# EAGLE design board (EAGLE 7.7.0)
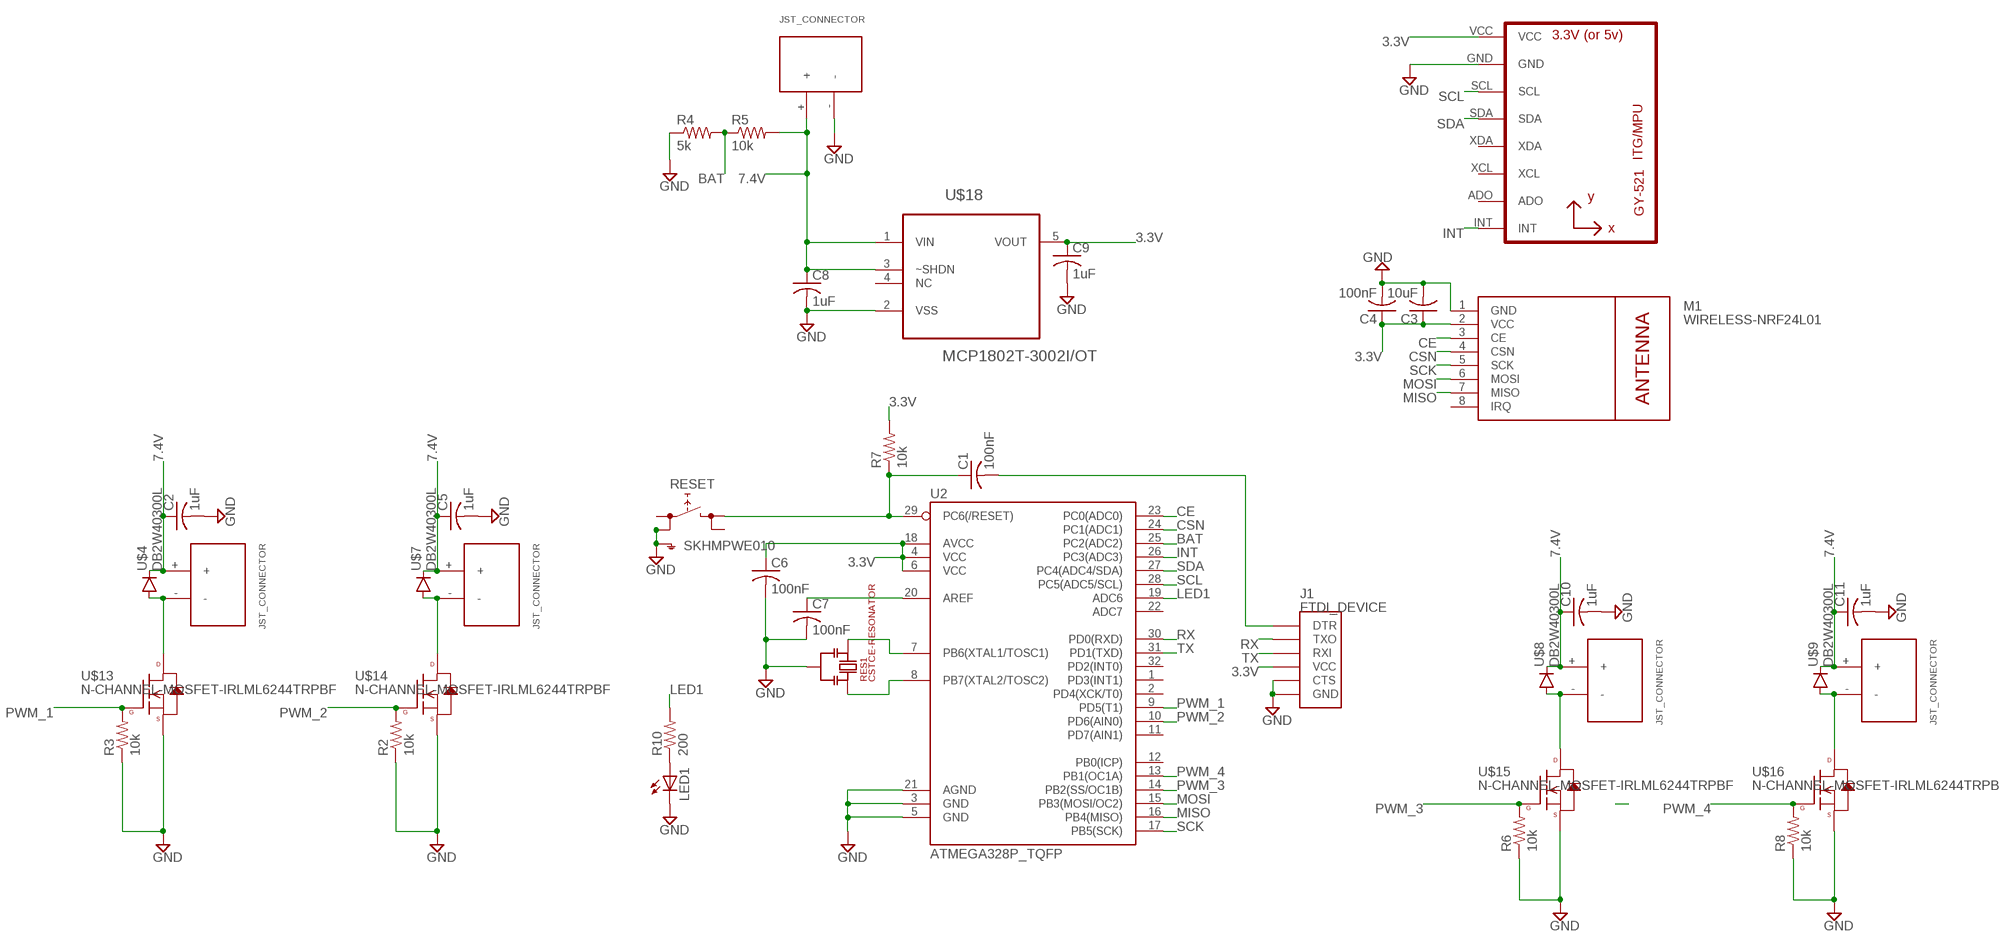
[diagram p0: schematic, sheet 1]

## Parts
C1  100nF  C-USC0603  [C0603]
C2  1uF  C-USC0603  [C0603]
C3  10uF  C-USC0603  [C0603]
C4  100nF  C-USC0603  [C0603]
C5  1uF  C-USC0603  [C0603]
C6  100nF  C-USC0603  [C0603]
C7  100nF  C-USC0603  [C0603]
C8  1uF  C-USC0603  [C0603]
C9  1uF  C-USC0603  [C0603]
C10  1uF  C-USC0603  [C0603]
C11  1uF  C-USC0603  [C0603]
J1  FTDI_DEVICE  [FTDI_DEVICE_SIDE]
LED1  LEDCHIP-LED0603  [CHIP-LED0603]
M1  WIRELESS-NRF24L01  [WIRELESS-NRF24L01]
R2  10k  R-US_R0603  [R0603]
R3  10k  R-US_R0603  [R0603]
R4  5k  R-US_R0603  [R0603]
R5  10k  R-US_R0603  [R0603]
R6  10k  R-US_R0603  [R0603]
R7  10k  R-US_R0603  [R0603]
R8  10k  R-US_R0603  [R0603]
R10  200  R-US_R0603  [R0603]
RES1  CSTCE-RESONATOR  [CSTCE16M0V53-R0]
RESET  SKHMPWE010  [SKHMPXE010]
U1  GY-521MPU6050  [GY-521]
U2  ATMEGA328P_TQFP  [TQFP32-08]
U$3  JST_CONNECTOR_FEMALE  [JST_CONNECTOR_FEMALE]
U$4  DB2W40300L  [MINI2-F3-B]
U$7  DB2W40300L  [MINI2-F3-B]
U$8  DB2W40300L  [MINI2-F3-B]
U$9  DB2W40300L  [MINI2-F3-B]
U$10  JST_CONNECTOR_FEMALE  [JST_CONNECTOR_FEMALE]
U$11  JST_CONNECTOR_FEMALE  [JST_CONNECTOR_FEMALE]
U$12  JST_CONNECTOR_FEMALE  [JST_CONNECTOR_FEMALE]
U$13  N-CHANNEL-MOSFET-IRLML6244TRPBF  [SOT23-3]
U$14  N-CHANNEL-MOSFET-IRLML6244TRPBF  [SOT23-3]
U$15  N-CHANNEL-MOSFET-IRLML6244TRPBF  [SOT23-3]
U$16  N-CHANNEL-MOSFET-IRLML6244TRPBF  [SOT23-3]
U$17  JST_CONNECTOR_FEMALE  [JST_CONNECTOR_FEMALE]
U$18  MCP1802T-3002I/OT  [SOT95P270X145-5N]

## Nets
3.3V: C3.1 C4.1 C6.1 C9.1 J1.P$4(VCC) M1.2(VCC) R7.2 U1.VCC U2.4(VCC) U2.6(VCC) U2.18(AVCC) U$18.5(VOUT)
7.4V: C2.1 C5.1 C8.1 C10.1 C11.1 R5.2 U$3.+ U$4.NEG(GPIN) U$7.NEG(GPIN) U$8.NEG(GPIN) U$9.NEG(GPIN) U$10.+ U$11.+ U$12.+ U$17.+ U$18.1(VIN) U$18.3(~SHDN)
BAT: R4.2 R5.1 U2.25(PC2(ADC2))
CE: M1.3(CE) U2.23(PC0(ADC0))
CSN: M1.4(CSN) U2.24(PC1(ADC1))
GND: C2.2 C3.2 C4.2 C5.2 C6.2 C7.2 C8.2 C9.2 C10.2 C11.2 J1.P$5(CTS) J1.P$6(GND) LED1.C M1.1(GND) R2.1 R3.1 R4.1 R6.1 R8.1 RES1.P$2 RESET.2(1.2) RESET.5(SH) U1.GND U2.3(GND) U2.5(GND) U2.21(AGND) U$13.2(S) U$14.2(S) U$15.2(S) U$16.2(S) U$17.- U$18.2(VSS)
INT: U1.INT U2.26(PC3(ADC3))
LED1: R10.2 U2.19(ADC6)
MISO: M1.7(MISO) U2.16(PB4(MISO))
MOSI: M1.6(MOSI) U2.15(PB3(MOSI/OC2))
N$1: RES1.P$3 U2.7(PB6(XTAL1/TOSC1))
N$2: RES1.P$1 U2.8(PB7(XTAL2/TOSC2))
N$3: U$8.POS(PPIN) U$11.- U$15.3(D)
N$8: LED1.A R10.1
N$11: C7.1 U2.20(AREF)
N$12: C1.1 R7.1 RESET.3(2.1) U2.29(PC6(/RESET))
N$13: C1.2 J1.P$1(DTR)
N$15: U$3.- U$4.POS(PPIN) U$13.3(D)
N$17: U$7.POS(PPIN) U$10.- U$14.3(D)
N$21: U$9.POS(PPIN) U$12.- U$16.3(D)
PWM_1: R3.2 U2.9(PD5(T1)) U$13.1(G)
PWM_2: R2.2 U2.10(PD6(AIN0)) U$14.1(G)
PWM_3: R6.2 U2.14(PB2(SS/OC1B)) U$15.1(G)
PWM_4: R8.2 U2.13(PB1(OC1A)) U$16.1(G)
RX: J1.P$2(TXO) U2.30(PD0(RXD))
SCK: M1.5(SCK) U2.17(PB5(SCK))
SCL: U1.SCL U2.28(PC5(ADC5/SCL))
SDA: U1.SDA U2.27(PC4(ADC4/SDA))
TX: J1.P$3(RXI) U2.31(PD1(TXD))
Unconnected: M1.8(IRQ) RESET.1(1.1) RESET.4(2.2) U1.ADO U1.XCL U1.XDA U2.1(PD3(INT1)) U2.2(PD4(XCK/T0)) U2.11(PD7(AIN1)) U2.12(PB0(ICP)) U2.22(ADC7) U2.32(PD2(INT0)) U$18.4(NC)

## Library data of the parts
C1-C11 = rcl:C-US: CAPACITOR, American symbol
J1 = quad:FTDI_DEVICE: Connector which mates to FTDI basic or FTDI cable.
LED1 = led:LED: LED OSRAM: - CHIPLED LG R971, LG N971, LY N971, LG Q971, LY Q971, LO R971, LY R971 LH N974, LH R974 LS Q976, LO Q976, LY Q976 LO Q996 - Hyper CHIPLED LW Q18S LB Q993, LB Q99A, LB R99A - SideLED LS A670, LO A670, LY A670, LG A670, LP A670 LB A673, LV A673, LT A673, LW A673 LH A674 LY A675 LS A676, LA A676, LO A676, LY A676, LW A676 LS A679, LY A679, LG A679 - Hyper Micro SIDELED® LS Y876, LA Y876, LO Y876, LY Y876 LT Y87S - SmartLED LW L88C, LW L88S LB L89C, LB L89S, LG L890 LS L89K, LO L89K, LY L89K LS L896, LA L896, LO L896, LY L896 - TOPLED LS T670, LO T670, LY T670, LG T670, LP T670 LSG T670, LSP T670, LSY T670, LOP T670, LYG T670 LG T671, LOG T671, LSG T671 LB T673, LV T673, LT T673, LW T673 LH T674 LS T676, LA T676, LO T676, LY T676, LB T676, LH T676, LSB T676, LW T676 LB T67C, LV T67C, LT T67C, LS T67K, LO T67K, LY T67K, LW E67C LS E67B, LA E67B, LO E67B, LY E67B, LB E67C, LV E67C, LT E67C LW T67C LS T679, LY T679, LG T679 LS T770, LO T770, LY T770, LG T770, LP T770 LB T773, LV T773, LT T773, LW T773 LH T774 LS E675, LA E675, LY E675, LS T675 LS T776, LA T776, LO T776, LY T776, LB T776 LHGB T686 LT T68C, LB T68C - Hyper Mini TOPLED® LB M676 - Mini TOPLED Santana® LG M470 LS M47K, LO M47K, LY M47K Source: http://www.osram.convergy.de LUXEON: - LUMILED® LXK2-PW12-R00, LXK2-PW12-S00, LXK2-PW14-U00, LXK2-PW14-V00 LXK2-PM12-R00, LXK2-PM12-S00, LXK2-PM14-U00 LXK2-PE12-Q00, LXK2-PE12-R00, LXK2-PE12-S00, LXK2-PE14-T00, LXK2-PE14-U00 LXK2-PB12-K00, LXK2-PB12-L00, LXK2-PB12-M00, LXK2-PB14-N00, LXK2-PB14-P00, LXK2-PB14-Q00 LXK2-PR12-L00, LXK2-PR12-M00, LXK2-PR14-Q00, LXK2-PR14-R00 LXK2-PD12-Q00, LXK2-PD12-R00, LXK2-PD12-S00 LXK2-PH12-R00, LXK2-PH12-S00 LXK2-PL12-P00, LXK2-PL12-Q00, LXK2-PL12-R00 Source: www.luxeon.com KINGBRIGHT: KA-3528ASYC Source: www.kingbright.com
M1 = quad:WIRELESS-NRF24L01: 2.4 GHz Wireless Module based on NRF24L01 chip
R2-R8 R10 = rcl:R-US_: RESISTOR, American symbol
RES1 = quad:CSTCE-RESONATOR: Murata Electronics Resonator
RESET = switch:SKHMP*E010: 6.2 X 6.5mm TACT Switch (SMD) Source: http://www3.alps.co.jp/WebObjects/catalog.woa/PDF/E/Switch/Tact/SKHM/SKHM.PDF
U1 = quad:GY-521
U2 = quad:ATMEGA328P_TQFP; PROD_ID: IC-09069
U$3 U$10-U$12 U$17 = quad:JST_CONNECTOR_FEMALE
U$4 U$7-U$9 = quad:DB2W40300L
U$13-U$16 = quad:N-CHANNEL-MOSFET: N-Channel MOSFET Mode Field Effect Transistor; DATASHEET: http://www.mouser.com/ds/2/196/irlml6244pbf-936666.pdf; MOUSER: 942-IRLML6244TRPBF; URL: http://www.mouser.com/Search/ProductDetail.aspx?R=IRLML6244TRPBFvirtualkey57370000virtualkey942-IRLML6244TRPBF
U$18 = quad:MCP1802T-3002I/OT: Low Quiescent Current LDO; MPN: MCP1802T-3002I/OT; OC_FARNELL: 1578373; OC_NEWARK: 54M4837; PACKAGE: SOT-5; SUPPLIER: Microchip

## Net classes
0 default: clearance 0.205 mm

## Board
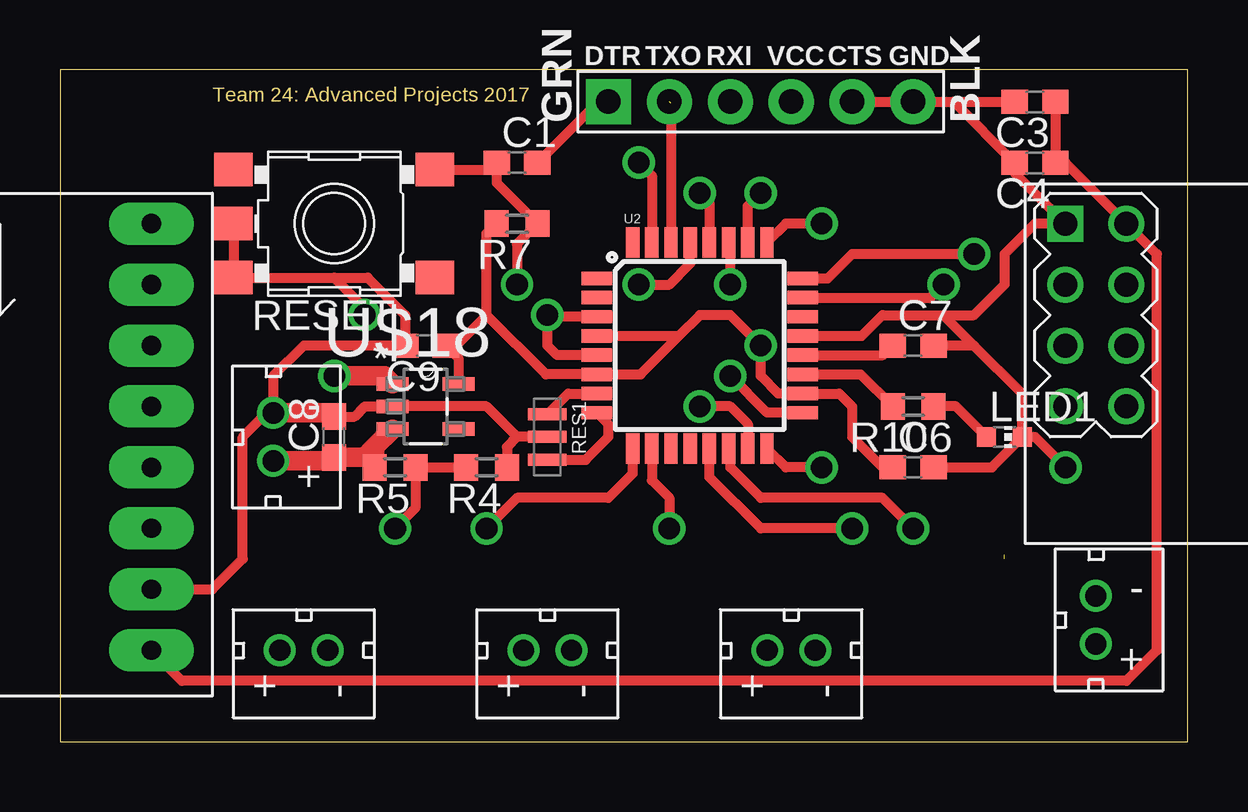
[diagram p1: board, top side]
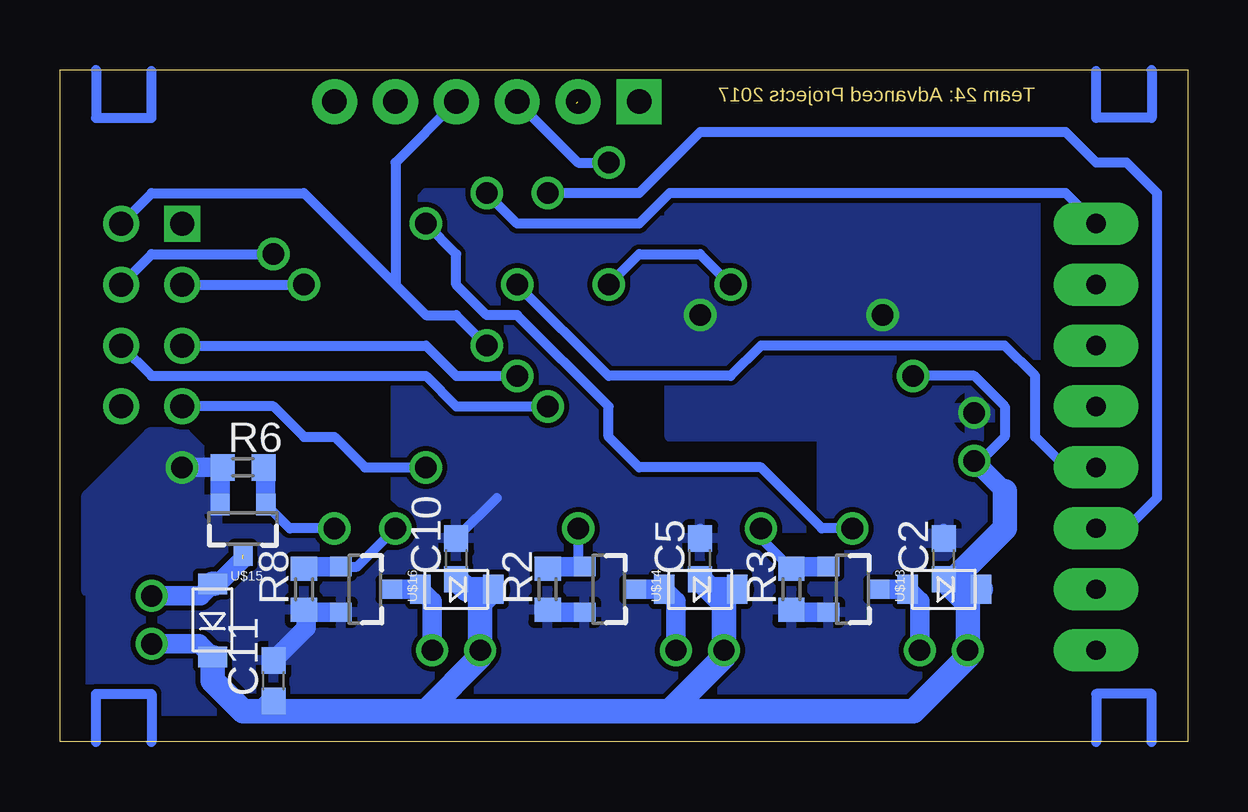
[diagram p2: board, bottom side, seen from below]

Size 47 x 28 mm. Coordinates in mm from the lower left corner, seen from the top.
Outline: 0,0 47,0 47,28 0,28 0,0
Copper layers (1*16): Top 0.0356mm / dielectric 1.5011mm / Bottom 0.0356mm
Design rules "LaenPCBOrder": minimum track width 6mil, minimum drill 13mil, track to track 6mil, track to pad 6mil, pad to pad 6mil, via to via 6mil, smd to smd 6mil, copper to edge 15mil, drill to drill 6mil, minimum pad ring 7mil, minimum via ring 7mil, stop-mask expansion 3mil, vias tented up to drill 0mil, thermal gap 10mil

### Footprints (pad centres in the part's own frame; a part is rotated, then mirrored left to right if it is on the bottom)
C0603 = smd 1.1 x 1: 1 -0.85,0; 2 0.85,0
FTDI_DEVICE_SIDE = drill 1.016 pad 1.88 square: P$1 -6.35,0 | drill 1.016 pad 1.88: P$2 -3.81,0; P$3 -1.27,0; P$4 1.27,0; P$5 3.81,0; P$6 6.35,0
CHIP-LED0603 = smd 0.8 x 0.8: A 0,-0.75; C 0,0.75
WIRELESS-NRF24L01 = drill 1 square: 1 -12.7,6.35 | drill 1: 2 -10.16,6.35; 3 -12.7,3.81; 4 -10.16,3.81; 5 -12.7,1.27; 6 -10.16,1.27; 7 -12.7,-1.27; 8 -10.16,-1.27
R0603 = smd 1 x 1.1: 1 -0.85,0; 2 0.85,0
CSTCE16M0V53-R0 = smd 1.6 x 0.5: P$1 0,0.95; P$2 0,0; P$3 0,-0.95
SKHMPXE010 = smd 1.6 x 1.4: 1 -4.2,2.25; 2 4.2,2.25; 3 -4.2,-2.25; 4 4.2,-2.25; 5 4.2,0
GY-521 = drill 0.8 pad 1.778 long: ADO -8.89,-6.35; GND -8.89,6.35; INT -8.89,-8.89; SCL -8.89,3.81; SDA -8.89,1.27; VCC -8.89,8.89; XCL -8.89,-3.81; XDA -8.89,-1.27
TQFP32-08 = smd 1.27 x 0.559: 1 -4.293,2.8; 2 -4.293,2; 3 -4.293,1.2; 4 -4.293,0.4; 5 -4.293,-0.4; 6 -4.293,-1.2; 7 -4.293,-2; 8 -4.293,-2.8; 17 4.293,-2.8; 18 4.293,-2; 19 4.293,-1.2; 20 4.293,-0.4; 21 4.293,0.4; 22 4.293,1.2; 23 4.293,2; 24 4.293,2.8 | smd 0.559 x 1.27: 9 -2.8,-4.293; 10 -2,-4.293; 11 -1.2,-4.293; 12 -0.4,-4.293; 13 0.4,-4.293; 14 1.2,-4.293; 15 2,-4.293; 16 2.8,-4.293; 25 2.8,4.293; 26 2,4.293; 27 1.2,4.293; 28 0.4,4.293; 29 -0.4,4.293; 30 -1.2,4.293; 31 -2,4.293; 32 -2.8,4.293
JST_CONNECTOR_FEMALE = drill 0.889: + 0,1; - 0,-1
MINI2-F3-B = smd 1.22 x 0.85: NEG 0,1.55; POS 0,-1.5
SOT23-3 = smd 0.8 x 0.9: 1 -0.95,-1; 2 0.95,-1; 3 0,1.1
SOT95P270X145-5N = smd 1.321 x 0.559: 1 -1.372,0.94; 2 -1.372,0; 3 -1.372,-0.94; 4 1.372,-0.94; 5 1.372,0.94

### Placement (x,y rotation side)
C1  19.05,24.13 0 top
C2  10.16,7.62 90 bottom
C3  40.64,26.67 180 top
C4  40.64,24.13 180 top
C5  20.32,7.62 90 bottom
C6  35.56,11.43 0 top
C7  35.56,16.51 0 top
C8  11.43,12.7 90 top
C9  15.24,16.51 180 top
C10  30.48,7.62 90 bottom
C11  38.1,2.54 90 bottom
J1  29.21,26.67 0 top
LED1  39.37,12.7 270 top
M1  54.61,15.24 0 top
R2  26.67,6.35 90 bottom
R3  16.51,6.35 90 bottom
R4  17.78,11.43 180 top
R5  13.97,11.43 180 top
R6  39.37,11.43 0 bottom
R7  19.05,21.59 180 top
R8  36.83,6.35 90 bottom
R10  35.56,13.97 180 top
RES1  20.32,12.7 180 top
RESET  11.43,21.59 180 top
U1  -5.08,12.7 180 top
U2  26.67,16.51 0 top
U$3  10.16,3.81 90 top
U$4  10.16,6.35 270 bottom
U$7  20.32,6.35 270 bottom
U$8  40.64,5.08 180 bottom
U$9  30.48,6.35 270 bottom
U$10  20.32,3.81 90 top
U$11  43.18,5.08 180 top
U$12  30.48,3.81 90 top
U$13  13.97,6.35 270 bottom
U$14  24.13,6.35 270 bottom
U$15  39.37,8.89 180 bottom
U$16  34.29,6.35 270 bottom
U$17  8.89,12.7 180 top
U$18  15.24,13.97 0 top

### Tracks (layer width: path | path; a pad name or v marks a point on that pad's centre or on a via)
3.3V  (via drill 0.9)
  Top 0.406: C6.1 34.29,11.43 33.02,12.7 33.02,13.97 32.48,14.51 U2.18 29.94,14.51 29.21,15.24 v29.21,16.51 27.94,17.78 26.67,17.78 25.8,16.91 | U$18.5 16.61,15.99 C9.1 16.51,16.51 17.78,17.78 | 17.78,17.78 17.78,21.17 R7.2 | U2.6 22.31,15.24 | 22.45,15.24 U2.6 | U2.6 20.25,15.31 17.78,17.78 | U2.6 24.2,15.31 25.8,16.91 | U2.4 25.8,16.91 | C3.1 C4.1 41.91,24.13 M1.2 45.72,20.32 45.72,3.81 44.45,2.54 5.08,2.54 U1.VCC
  Bottom 0.406: 33.02,19.05 31.75,17.78 30.48,17.78 v29.21,16.51 | J1.P$4 33.02,24.13 33.02,19.05 | M1.2 43.18,22.86 36.83,22.86 33.02,19.05
7.4V  (via drill 0.9)
  Top 0.406: 9.89,11.7 U$17.+ 8.62,11.7
  Top 0.813: U$17.+ 11.28,11.7 C8.1 12.69,11.85 13.12,12.28 | U$18.1 13.54,15.24 v11.43,15.24 | U$18.3 13.12,12.28 | 13.12,12.28 R5.2
  Bottom 0.406: v11.43,15.24 8.89,15.24 7.62,13.97 7.62,12.7 8.62,11.7
  Bottom 0.61: 8.62,11.7 U$17.+
  Bottom 0.813: U$12.+ 29.48,3.54 | U$8.NEG 41.19,4.08 U$11.+ | 7.62,10.43 U$17.+
  Bottom 1.016: 21.59,1.27 31.75,1.27 | 31.75,1.27 38.52,1.27 | U$8.NEG 40.64,2.54 39.37,1.27 38.52,1.27 | C11.1 38.52,1.27 | U$7.NEG 19.9,6.35 C5.1 19.32,5.77 U$10.+ 19.32,3.54 21.59,1.27 | C10.1 30.06,6.35 U$9.NEG 29.48,5.8 U$12.+ | 29.48,3.54 31.75,1.27 | 9.74,6.35 C2.1 9.74,6.77 7.62,8.89 7.62,10.43 | 9.74,6.35 U$4.NEG | 9.74,6.35 9.16,5.77 U$3.+ 9.16,3.54 11.43,1.27 21.59,1.27
BAT  (via drill 0.9)
  Top 0.406: v13.97,8.89 14.82,9.74 R5.1 R4.2 16.51,11.43 | v31.75,21.59 30.26,21.59 U2.25
  Bottom 0.406: v13.97,8.89 15.24,8.89 17.78,11.43 22.86,11.43 24.13,12.7 24.13,13.97 27.94,17.78 29.21,17.78 30.48,19.05 30.48,20.32 v31.75,21.59
CE  (via drill 0.9)
  Top 0.406: U2.23 36.29,18.51 v36.83,19.05
  Bottom 0.406: M1.3 v36.83,19.05
CSN  (via drill 0.9)
  Top 0.406: U2.24 32.01,19.31 33.02,20.32 v38.1,20.32
  Bottom 0.406: M1.4 43.18,20.32 v38.1,20.32
GND  (via drill 0.9)
  Top 0.406: C8.2 12.28,13.55 12.7,13.97 U$18.2 17.78,13.97 19.05,12.7 | RESET.5 RESET.2 11.43,19.34 | C6.2 38.85,11.43 LED1.C | LED1.C 40.64,12.7 v41.91,11.43 | 11.43,19.34 12.83,19.34 14.39,17.78 C9.2 10.16,16.51 8.89,15.24 U$17.- 8.62,13.7 7.62,12.7 7.62,7.62 6.35,6.35 U1.GND | J1.P$5 J1.P$6 37.25,26.67 | 22.93,17.71 U2.3 20.39,17.71 v20.32,17.78 20.32,16.51 20.72,16.11 U2.5 | v12.7,17.78 12.7,18.07 11.43,19.34 | RES1.P$2 19.05,12.7 | 19.05,12.7 18.63,12.28 R4.1 | 37.25,26.67 C3.2 | 37.25,26.67 C4.2 39.79,23.71 M1.1 40.64,21.59 39.37,20.32 39.37,19.05 38.1,17.78 36.83,17.78 | LED1.C 40.12,14.49 38.1,16.51 | 38.1,16.51 C7.2 | U2.21 33.42,16.91 34.29,17.78 36.83,17.78 | 36.83,17.78 38.1,16.51
  Top 0.813: C8.2 11.28,13.7 U$17.-
  Bottom 0.406: C2.2 10.16,8.89 | 28.79,10.16 C10.2 | C5.2 20.32,8.89
  Bottom 0.813: U$13.2 16.41,5.4 R3.1 | U$14.2 26.57,5.4 R2.1 | U$16.2 36.73,5.4 | 36.73,5.4 R8.1 | U$15.2 40.32,11.33 R6.1 v41.91,11.43 | 36.73,5.4 36.73,4.76 C11.2
  pour Bottom: 20.32,20.32 22.86,22.86 31.75,22.86 33.02,21.59 33.02,10.16 31.75,8.89 22.86,8.89 20.32,11.43
  pour Bottom: 43.18,8.89 8.89,8.89 7.62,7.62 7.62,1.27 45.72,1.27 45.72,6.35
  pour Bottom: 45.72,6.35 45.72,10.16 43.18,12.7 41.91,12.7 40.64,11.43 40.64,8.89 43.18,8.89
  pour Bottom: 22.86,12.7 17.78,12.7 13.97,8.89 22.86,8.89
  pour Bottom: 20.32,20.32 13.97,20.32 11.43,17.78 11.43,8.89 20.32,8.89
  pour Bottom: 11.43,17.78 7.62,17.78 7.62,2.54 12.7,2.54 12.7,16.51
  pour Bottom: 7.62,17.78 6.35,16.51 6.35,3.81 8.89,1.27 15.24,1.27 15.24,13.97 11.43,17.78
  pour Bottom: 21.59,21.59 21.59,24.13 21.59,25.4 20.32,26.67 7.62,26.67 6.35,25.4 6.35,12.7 21.59,12.7
INT  (via drill 0.9)
  Top 0.406: U2.26 28.67,22.32 v29.21,22.86
  Bottom 0.406: v29.21,22.86 27.94,21.59 22.86,21.59 21.59,22.86 5.08,22.86 U1.INT
LED1
  Top 0.406: U2.19 33.37,15.31 R10.2
MISO  (via drill 0.9)
  Top 0.406: U2.16 30.26,11.43 v31.75,11.43
  Bottom 0.406: v31.75,11.43 34.29,11.43 35.56,12.7 36.83,12.7 38.1,13.97 M1.7
MOSI  (via drill 0.9)
  Top 0.406: U2.15 28.67,13.24 27.94,13.97 v26.67,13.97
  Bottom 0.406: v26.67,13.97 30.48,13.97 31.75,15.24 43.18,15.24 M1.6
N$1
  Top 0.406: RES1.P$3 21.18,14.51 U2.7
N$2
  Top 0.406: RES1.P$1 21.91,11.75 22.86,12.7 22.86,13.23 U2.8
N$3  (1 unrouted)
  Bottom 0.813: 40.58,6.58 40.41,6.58 39.37,7.62 | U$8.POS 41.14,6.08 U$11.-
  Bottom 1.016: U$8.POS 40.58,6.58
N$5
  Bottom 0.406: 1.5,0 1.5,2 3.81,2 3.81,0
N$6
  Bottom 0.406: 1.5,28 1.5,26 3.81,26 3.81,27.94
N$7
  Bottom 0.406: 45.5,0 45.5,2 43.18,2 43.18,0
N$8
  Top 0.406: LED1.A 37.35,13.97 R10.1
N$9
  Bottom 0.406: 45.5,28 45.5,26 43.18,26 43.18,27.94
N$11
  Top 0.406: U2.20 34.31,16.11 C7.1
N$12  (via drill 0.9)
  Top 0.406: RESET.3 17.91,23.84 C1.1 18.2,23.29 R7.1 19.05,20.74 v19.05,19.05 | v24.13,19.05 25.4,19.05 26.27,19.92 U2.29
  Bottom 0.406: v24.13,19.05 22.86,20.32 20.32,20.32 v19.05,19.05
N$13
  Top 0.406: C1.2 22.44,26.67 J1.P$1
N$15
  Bottom 0.813: U$13.3 U$4.POS 11.16,5.85 U$3.-
N$17
  Bottom 0.813: U$14.3 U$7.POS 21.32,5.85 U$10.-
N$21
  Bottom 0.813: U$16.3 U$9.POS 31.48,5.85 U$12.-
PWM_1  (via drill 0.9)
  Top 0.406: U2.9 23.87,11.17 22.86,10.16 19.05,10.16 v17.78,8.89
  Bottom 0.406: R3.2 17.78,8.47 v17.78,8.89
  Bottom 0.813: U$13.1 16.41,7.3 R3.2
PWM_2  (via drill 0.9)
  Top 0.406: U2.10 24.67,10.89 25.4,10.16 v25.4,8.89
  Bottom 0.406: v25.4,8.89 25.4,7.57 U$14.1
  Bottom 0.813: U$14.1 26.57,7.3 R2.2
PWM_3  (via drill 0.9)
  Top 0.406: v35.56,8.89 34.29,10.16 29.21,10.16 27.94,11.43 27.94,12.15 U2.14
  Bottom 0.406: v35.56,8.89 37.42,8.89 U$15.1
  Bottom 0.813: U$15.1 38.42,11.33 R6.2
PWM_4  (via drill 0.9)
  Top 0.406: v33.02,8.89 29.21,8.89 27.07,11.03 U2.13
  Bottom 0.406: U$16.1 34.61,7.3 v33.02,8.89
  Bottom 0.813: U$16.1 36.73,7.3 R8.2
RX  (1 unrouted)
  Top 0.406: 25.47,26.6 U2.30
SCK  (via drill 0.9)
  Top 0.406: U2.17 29.47,13.71 v27.94,15.24
  Bottom 0.406: M1.5 31.75,16.51 30.48,15.24 v27.94,15.24
SCL  (via drill 0.9)
  Top 0.406: v26.67,22.86 27.07,22.46 U2.28
  Bottom 0.406: v26.67,22.86 22.86,22.86 20.32,25.4 5.08,25.4 3.81,24.13 2.54,24.13 1.27,22.86 1.27,10.16 2.54,8.89 U1.SCL
SDA  (via drill 0.9)
  Top 0.406: v27.94,19.05 27.94,20.73 U2.27
  Bottom 0.406: v27.94,19.05 24.13,15.24 19.05,15.24 17.78,16.51 7.62,16.51 6.35,15.24 6.35,12.7 5.08,11.43 U1.SDA
TX  (via drill 0.9)
  Top 0.406: v24.13,24.13 24.67,23.59 U2.31
  Bottom 0.406: J1.P$3 25.4,24.13 v24.13,24.13

### Text on the board
Dimension: Team 24: Advanced Projects 2017